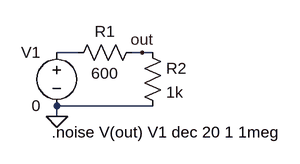
[diagram p0: schematic ExNoiseFigureRpLTspice.asc]
ExNoiseFigureRpLTspice.asc, the LTspice schematic file:
Version 4
SHEET 1 880 680
WIRE 0 -96 -32 -96
WIRE 96 -96 80 -96
WIRE 112 -96 96 -96
WIRE 112 -16 -32 -16
WIRE -32 0 -32 -16
FLAG -32 0 0
FLAG 96 -96 out
SYMBOL res 96 -112 R90
WINDOW 0 0 56 VBottom 2
WINDOW 3 32 56 VTop 2
SYMATTR InstName R1
SYMATTR Value 600
SYMBOL res 96 -112 R0
SYMATTR InstName R2
SYMATTR Value 1k
SYMBOL voltage -32 -112 M0
SYMATTR InstName V1
SYMATTR Value 0
TEXT -40 24 Left 2 !.noise V(out) V1 dec 20 1 1meg

The netlist it stands for:
* ExNoiseFigureRpLTspice.asc
R1 out N001 600
R2 out 0 1k
V1 N001 0 0
.noise V(out) V1 dec 20 1 1meg
.backanno
.end